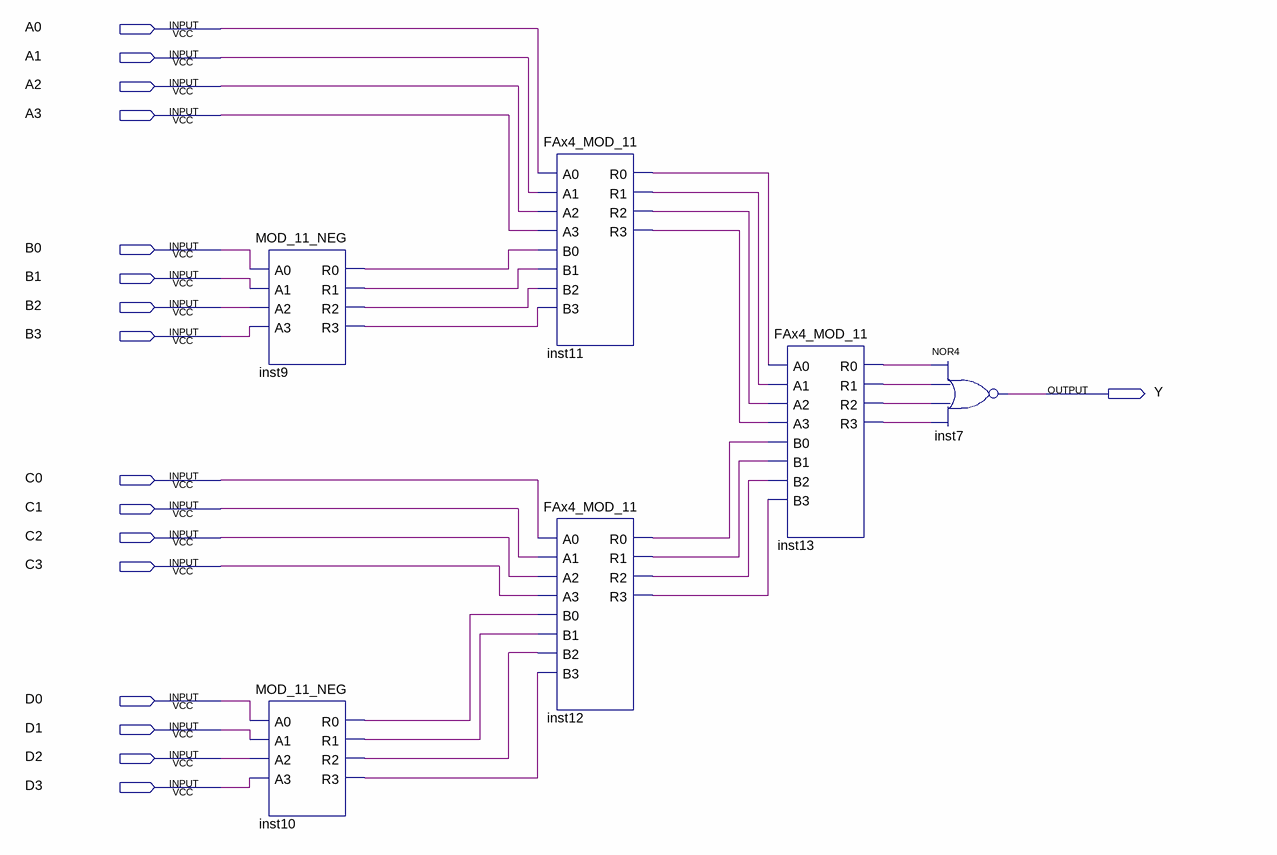
[diagram p0: schematic sheet]
// Quartus schematic main2.bdf as structural Verilog: 6 symbols, 17 pins
module main2 (
  input  A0,
  input  A1,
  input  A2,
  input  A3,
  input  B0,
  input  B1,
  input  B2,
  input  B3,
  input  C0,
  input  C1,
  input  C2,
  input  C3,
  input  D0,
  input  D1,
  input  D2,
  input  D3,
  output Y
);

  wire inst9_r0, inst9_r1, inst9_r2, inst9_r3, inst10_r0, inst10_r1, inst10_r2, inst10_r3, inst11_r0,
       inst11_r1, inst11_r2, inst11_r3, inst12_r0, inst12_r1, inst12_r2, inst12_r3, inst13_r0, inst13_r1,
       inst13_r2, inst13_r3;

  MOD_11_NEG inst9 (.A0(B0), .A1(B1), .A2(B2), .A3(B3), .R0(inst9_r0), .R1(inst9_r1), .R2(inst9_r2), .R3(inst9_r3));
  MOD_11_NEG inst10 (
    .A0(D0), .A1(D1), .A2(D2), .A3(D3), .R0(inst10_r0), .R1(inst10_r1), .R2(inst10_r2), .R3(inst10_r3));
  FAx4_MOD_11 inst11 (
    .A0(A0), .A1(A1), .A2(A2), .A3(A3), .B0(inst9_r0), .B1(inst9_r1), .B2(inst9_r2), .B3(inst9_r3),
    .R0(inst11_r0), .R1(inst11_r1), .R2(inst11_r2), .R3(inst11_r3));
  FAx4_MOD_11 inst12 (
    .A0(C0), .A1(C1), .A2(C2), .A3(C3), .B0(inst10_r0), .B1(inst10_r1), .B2(inst10_r2), .B3(inst10_r3),
    .R0(inst12_r0), .R1(inst12_r1), .R2(inst12_r2), .R3(inst12_r3));
  FAx4_MOD_11 inst13 (
    .A0(inst11_r0), .A1(inst11_r1), .A2(inst11_r2), .A3(inst11_r3), .B0(inst12_r0), .B1(inst12_r1),
    .B2(inst12_r2), .B3(inst12_r3), .R0(inst13_r0), .R1(inst13_r1), .R2(inst13_r2), .R3(inst13_r3));
  nor inst7 (Y, inst13_r0, inst13_r1, inst13_r2, inst13_r3);
endmodule
